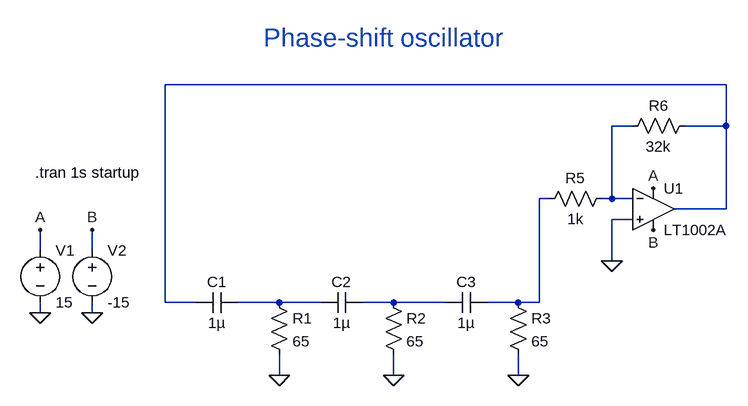
[diagram p0: schematic Phase-shift-oscillator-RC.asc]
Phase-shift-oscillator-RC.asc, the LTspice schematic file:
Version 4
SHEET 1 1140 680
WIRE 928 -176 64 -176
WIRE 784 -112 752 -112
WIRE 928 -112 928 -176
WIRE 928 -112 864 -112
WIRE 656 0 640 0
WIRE 752 0 752 -112
WIRE 752 0 736 0
WIRE 784 0 752 0
WIRE 928 16 928 -112
WIRE 928 16 848 16
WIRE 784 32 752 32
WIRE -128 80 -128 48
WIRE -48 80 -48 48
WIRE 752 96 752 32
WIRE 64 160 64 -176
WIRE 112 160 64 160
WIRE 240 160 176 160
WIRE 304 160 240 160
WIRE 416 160 368 160
WIRE 496 160 416 160
WIRE 608 160 560 160
WIRE 640 160 640 0
WIRE 640 160 608 160
WIRE -128 176 -128 160
WIRE -48 176 -48 160
WIRE 240 272 240 240
WIRE 416 272 416 240
WIRE 608 272 608 240
FLAG 608 272 0
FLAG 416 272 0
FLAG 240 272 0
FLAG 752 96 0
FLAG -128 176 0
FLAG -48 176 0
FLAG -128 48 A
FLAG 816 -16 A
FLAG -48 48 B
FLAG 816 48 B
SYMBOL res 224 144 R0
SYMATTR InstName R1
SYMATTR Value 65
SYMBOL res 400 144 R0
SYMATTR InstName R2
SYMATTR Value 65
SYMBOL res 592 144 R0
SYMATTR InstName R3
SYMATTR Value 65
SYMBOL cap 112 176 R270
WINDOW 0 32 32 VTop 2
WINDOW 3 0 32 VBottom 2
SYMATTR InstName C1
SYMATTR Value 1µ
SYMBOL cap 304 176 R270
WINDOW 0 32 32 VTop 2
WINDOW 3 0 32 VBottom 2
SYMATTR InstName C2
SYMATTR Value 1µ
SYMBOL cap 496 176 R270
WINDOW 0 32 32 VTop 2
WINDOW 3 0 32 VBottom 2
SYMATTR InstName C3
SYMATTR Value 1µ
SYMBOL res 752 -16 R90
WINDOW 0 0 56 VBottom 2
WINDOW 3 32 56 VTop 2
SYMATTR InstName R5
SYMATTR Value 1k
SYMBOL Opamps\\LT1002A 816 -48 R0
SYMATTR InstName U1
SYMBOL res 880 -128 R90
WINDOW 0 0 56 VBottom 2
WINDOW 3 32 56 VTop 2
SYMATTR InstName R6
SYMATTR Value 32k
SYMBOL voltage -128 64 R0
WINDOW 123 0 0 Left 2
WINDOW 39 0 0 Left 2
SYMATTR InstName V1
SYMATTR Value 15
SYMBOL voltage -48 64 R0
WINDOW 123 0 0 Left 2
WINDOW 39 0 0 Left 2
SYMATTR InstName V2
SYMATTR Value -15
TEXT -136 -40 Left 2 !.tran 1s startup
TEXT 216 -248 Left 4 ;Phase-shift oscillator

The netlist it stands for:
* Phase-shift-oscillator-RC.asc
R1 N004 0 65
R2 N005 0 65
R3 N003 0 65
C1 N001 N004 1µ
C2 N004 N005 1µ
C3 N005 N003 1µ
R5 N002 N003 1k
XU1 0 N002 A B N001 LT1002A  ; pins In+ In- V+ V- OUT
R6 N001 N002 32k
V1 A 0 15
V2 B 0 -15
.tran 1s startup
* Phase-shift oscillator
.backanno
.end